# Altium schematic sheet Microcontroller.SchDoc: Microcontroller
size A3; Engineer: Y.Meyer; Organization: Altium Limited; Address1: Laboratoire de Systèmes Embarqués; Address2: 7, rue de la Serre; Address3: 2610 Saint-Imier / Switzerland; Revision: V1.0; SheetNumber: 1; SheetTotal: 10; ProjectName: LCI Mainboard
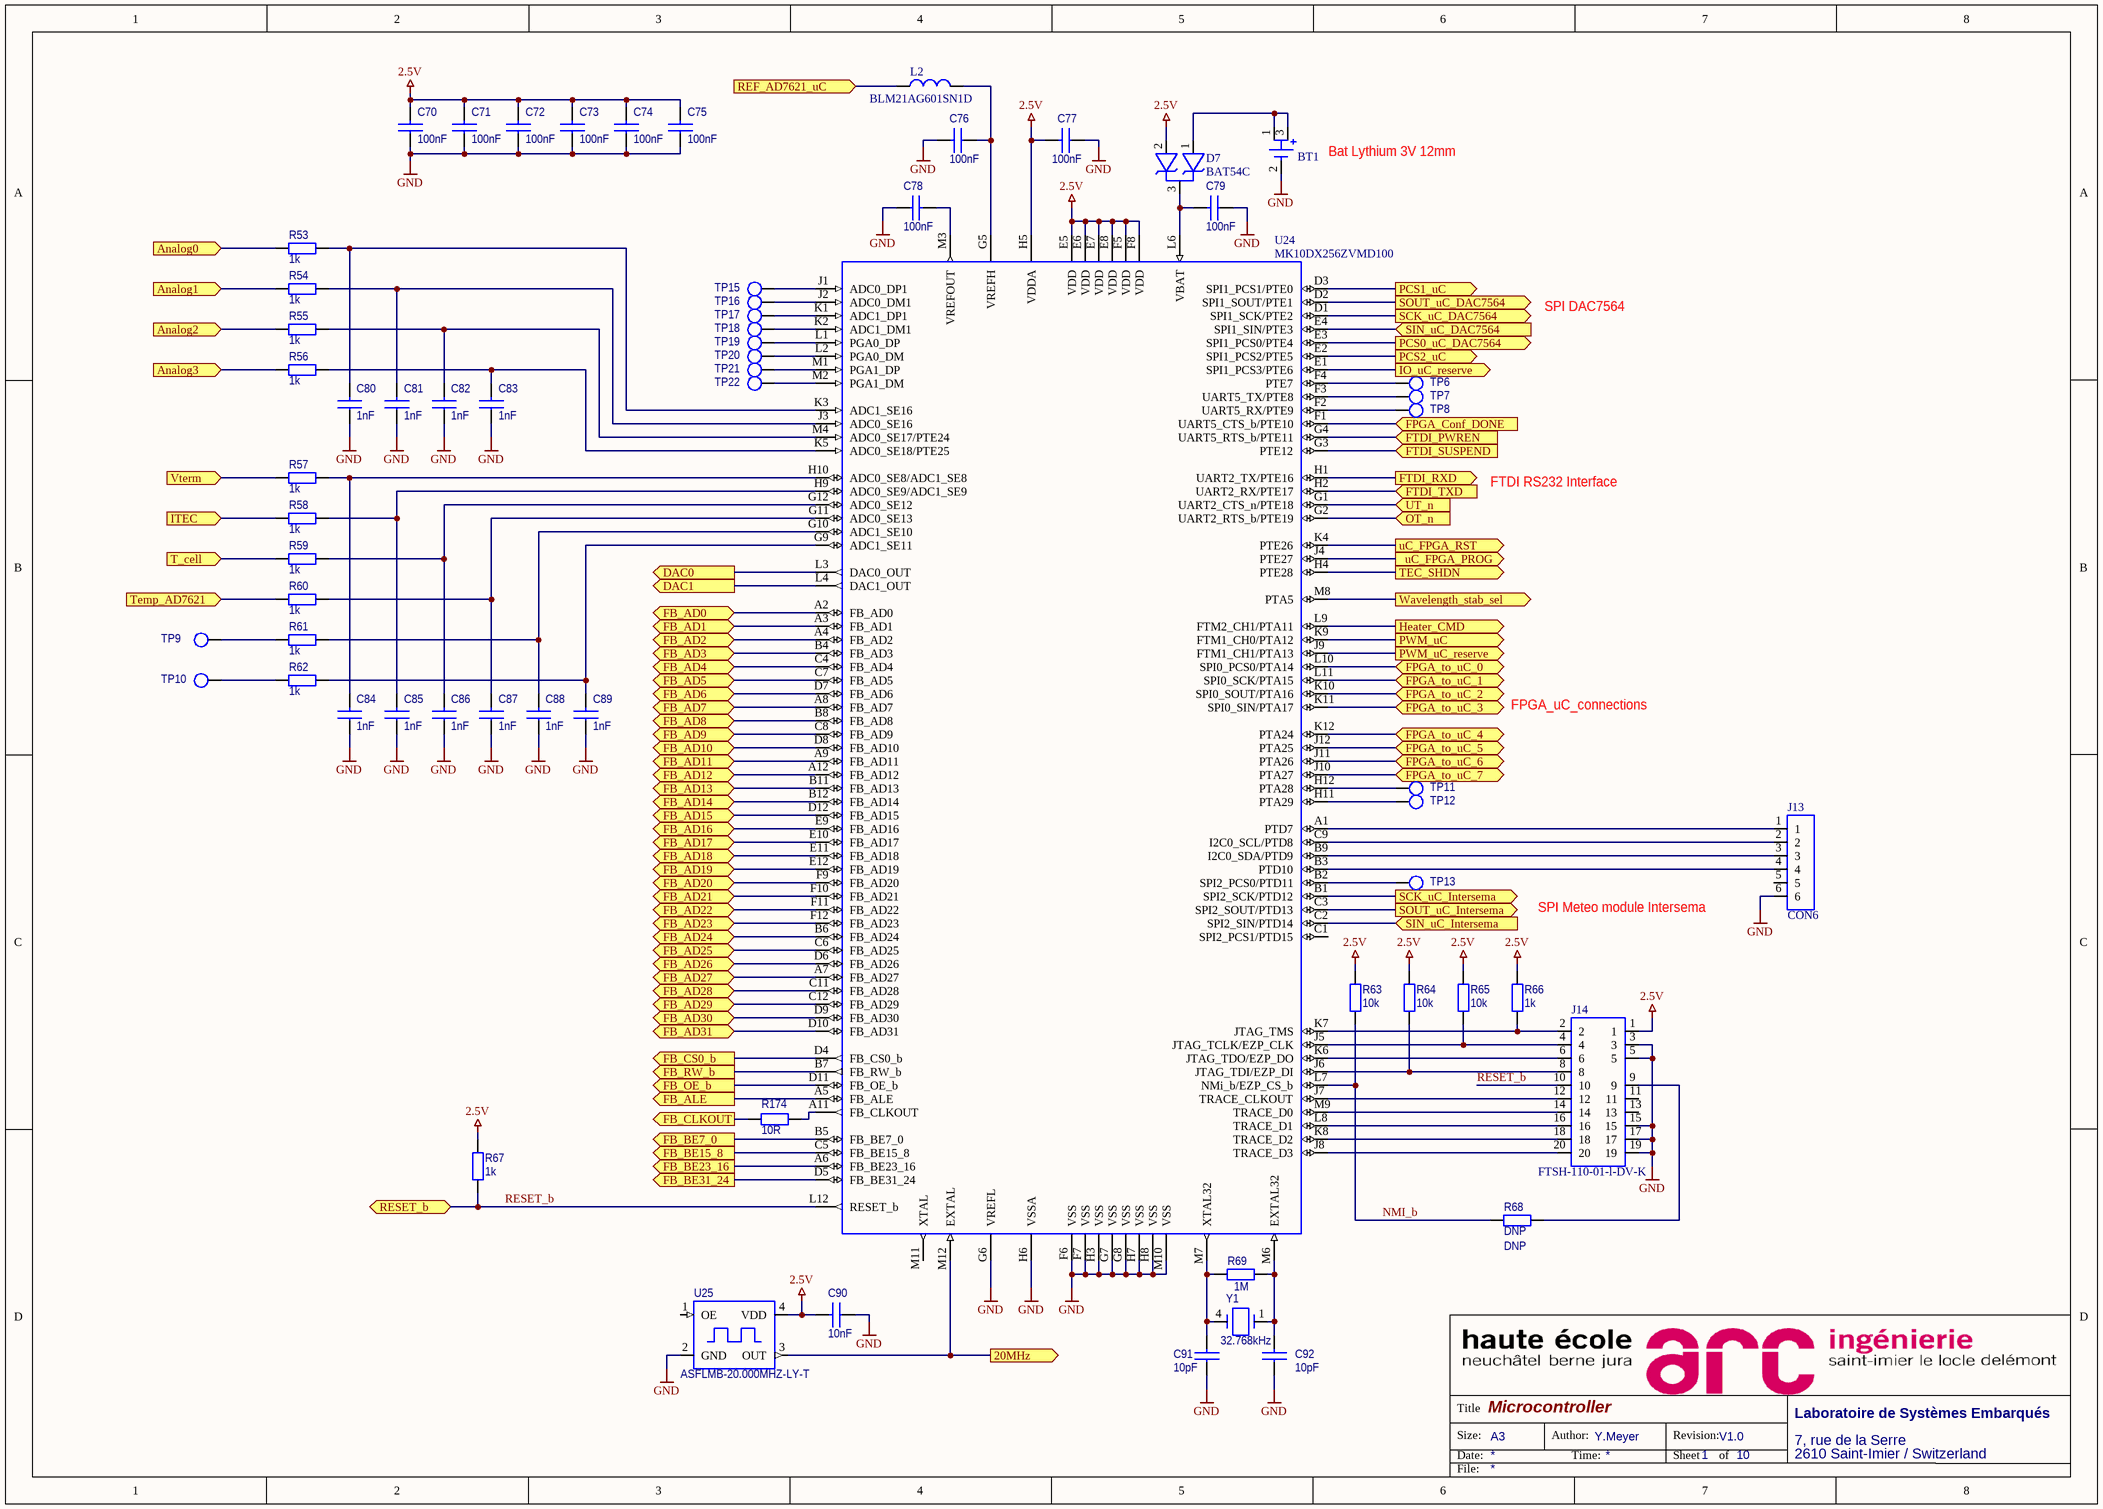
[diagram p0: Microcontroller.SchDoc]

## Parts
BT1  3000TR  [3000TR]  (value not drawn)
C70  100nF  [060301]
C71  100nF  [060301]
C72  100nF  [060301]
C73  100nF  [060301]
C74  100nF  [060301]
C75  100nF  [060301]
C76  100nF  [060301]
C77  100nF  [060301]
C78  100nF  [060301]
C79  100nF  [060301]
C80  1nF  [060301]
C81  1nF  [060301]
C82  1nF  [060301]
C83  1nF  [060301]
C84  1nF  [060301]
C85  1nF  [060301]
C86  1nF  [060301]
C87  1nF  [060301]
C88  1nF  [060301]
C89  1nF  [060301]
C90  10nF  [060301]
C91  10pF  [060301]
C92  10pF  [060301]
D7  BAT54C  [SOT2301]
J13  CON6  [J106A101]
J14  FTSH-110-01-l-DV-K  [FTSH-110-01-X-DV-EJ]
L2  BLM21AG601SN1D  [080501]
R53  1k  [060301]
R54  1k  [060301]
R55  1k  [060301]
R56  1k  [060301]
R57  1k  [060301]
R58  1k  [060301]
R59  1k  [060301]
R60  1k  [060301]
R61  1k  [060301]
R62  1k  [060301]
R63  10k  [060301]
R64  10k  [060301]
R65  10k  [060301]
R66  1k  [060301]
R67  1k  [060301]
R68  DNP  [060301]
R69  1M  [060301]
R174  10R  [060301]
TP6  Test point  [TP_SMD_06mm]  (value not drawn)
TP7  Test point  [TP_SMD_06mm]  (value not drawn)
TP8  Test point  [TP_SMD_06mm]  (value not drawn)
TP9  Test point  [TP_SMD_06mm]  (value not drawn)
TP10  Test point  [TP_SMD_06mm]  (value not drawn)
TP11  Test point  [TP_SMD_06mm]  (value not drawn)
TP12  Test point  [TP_SMD_06mm]  (value not drawn)
TP13  Test point  [TP_SMD_06mm]  (value not drawn)
TP15  Test point  [TP_SMD_06mm]  (value not drawn)
TP16  Test point  [TP_SMD_06mm]  (value not drawn)
TP17  Test point  [TP_SMD_06mm]  (value not drawn)
TP18  Test point  [TP_SMD_06mm]  (value not drawn)
TP19  Test point  [TP_SMD_06mm]  (value not drawn)
TP20  Test point  [TP_SMD_06mm]  (value not drawn)
TP21  Test point  [TP_SMD_06mm]  (value not drawn)
TP22  Test point  [TP_SMD_06mm]  (value not drawn)
U24  MK10DX256ZVMD100  [MAPBGA144]
U25  ASFLMB-20.000MHZ-LY-T  [OSC05]
Y1  value 32.768kHz  [XT-5]  (hidden comment: ECS-.327-12.5-17X-C-TR)

## Ports
20MHz (out), Analog0 (in), Analog1 (in), Analog2 (in), Analog3 (in), DAC0 (out), DAC1 (out), FB_AD0 (bidir), FB_AD1 (bidir), FB_AD2 (bidir), FB_AD3 (bidir), FB_AD4 (bidir), FB_AD5 (bidir), FB_AD6 (bidir), FB_AD7 (bidir), FB_AD8 (bidir), FB_AD9 (bidir), FB_AD10 (bidir), FB_AD11 (bidir), FB_AD12 (bidir), FB_AD13 (bidir), FB_AD14 (bidir), FB_AD15 (bidir), FB_AD16 (bidir), FB_AD17 (bidir), FB_AD18 (bidir), FB_AD19 (bidir), FB_AD20 (bidir), FB_AD21 (bidir), FB_AD22 (bidir), FB_AD23 (bidir), FB_AD24 (bidir), FB_AD25 (bidir), FB_AD26 (bidir), FB_AD27 (bidir), FB_AD28 (bidir), FB_AD29 (bidir), FB_AD30 (bidir), FB_AD31 (bidir), FB_ALE (out), FB_BE7_0 (out), FB_BE15_8 (out), FB_BE23_16 (out), FB_BE31_24 (out), FB_CLKOUT (out), FB_CS0_b (out), FB_OE_b (out), FB_RW_b (out), FPGA_Conf_DONE (in), FPGA_to_uC_0 (bidir), FPGA_to_uC_1 (bidir), FPGA_to_uC_2 (bidir), FPGA_to_uC_3 (bidir), FPGA_to_uC_4 (bidir), FPGA_to_uC_5 (bidir), FPGA_to_uC_6 (bidir), FPGA_to_uC_7 (bidir), FTDI_PWREN (in), FTDI_RXD (out), FTDI_SUSPEND (in), FTDI_TXD (in), Heater_CMD (out), IO_uC_reserve (out), ITEC (in), OT_n (in), PCS0_uC_DAC7564 (out), PCS1_uC (out), PCS2_uC (out), PWM_uC (out), PWM_uC_reserve (out), REF_AD7621_uC (in), RESET_b (bidir), SCK_uC_DAC7564 (out), SCK_uC_Intersema (out), SIN_uC_DAC7564 (in), SIN_uC_Intersema (in), SOUT_uC_DAC7564 (out), SOUT_uC_Intersema (out), T_cell (in), TEC_SHDN (out), Temp_AD7621 (in), uC_FPGA_PROG (out), uC_FPGA_RST (out), UT_n (in), Vterm (in), Wavelength_stab_sel (out)

## Nets
2.5V: C70.2 C71.2 C72.2 C73.2 C74.2 C75.2 C77.2 C90.2 D7.2(C2) J14.1 R63.1 R64.1 R65.1 R66.1 R67.1 U24.E5(VDD) U24.E6(VDD) U24.E7(VDD) U24.E8(VDD) U24.F5(VDD) U24.F8(VDD) U24.H5(VDDA) U25.4(VDD)
GND: BT1.2(C) C70.1 C71.1 C72.1 C73.1 C74.1 C75.1 C76.2 C77.1 C78.1 C79.1 C80.1 C81.1 C82.1 C83.1 C84.1 C85.1 C86.1 C87.1 C88.1 C89.1 C90.1 C91.1 C92.1 J13.6 J14.3 J14.5 J14.15 J14.17 J14.19 U24.F6(VSS) U24.F7(VSS) U24.G6(VREFL) U24.G7(VSS) U24.G8(VSS) U24.H3(VSS) U24.H6(VSSA) U24.H7(VSS) U24.H8(VSS) U24.M10(VSS) U25.2(GND)
20MHz: U24.M12(EXTAL) U25.3(OUT) ; port 20MHz
Analog0: R53.1 ; port Analog0
Analog1: R54.1 ; port Analog1
Analog2: R55.1 ; port Analog2
Analog3: R56.1 ; port Analog3
DAC0: U24.L3(DAC0_OUT) ; port DAC0
DAC1: U24.L4(DAC1_OUT) ; port DAC1
FB_AD0: U24.A2(FB_AD0) ; port FB_AD0
FB_AD1: U24.A3(FB_AD1) ; port FB_AD1
FB_AD2: U24.A4(FB_AD2) ; port FB_AD2
FB_AD3: U24.B4(FB_AD3) ; port FB_AD3
FB_AD4: U24.C4(FB_AD4) ; port FB_AD4
FB_AD5: U24.C7(FB_AD5) ; port FB_AD5
FB_AD6: U24.D7(FB_AD6) ; port FB_AD6
FB_AD7: U24.A8(FB_AD7) ; port FB_AD7
FB_AD8: U24.B8(FB_AD8) ; port FB_AD8
FB_AD9: U24.C8(FB_AD9) ; port FB_AD9
FB_AD10: U24.D8(FB_AD10) ; port FB_AD10
FB_AD11: U24.A9(FB_AD11) ; port FB_AD11
FB_AD12: U24.A12(FB_AD12) ; port FB_AD12
FB_AD13: U24.B11(FB_AD13) ; port FB_AD13
FB_AD14: U24.B12(FB_AD14) ; port FB_AD14
FB_AD15: U24.D12(FB_AD15) ; port FB_AD15
FB_AD16: U24.E9(FB_AD16) ; port FB_AD16
FB_AD17: U24.E10(FB_AD17) ; port FB_AD17
FB_AD18: U24.E11(FB_AD18) ; port FB_AD18
FB_AD19: U24.E12(FB_AD19) ; port FB_AD19
FB_AD20: U24.F9(FB_AD20) ; port FB_AD20
FB_AD21: U24.F10(FB_AD21) ; port FB_AD21
FB_AD22: U24.F11(FB_AD22) ; port FB_AD22
FB_AD23: U24.F12(FB_AD23) ; port FB_AD23
FB_AD24: U24.B6(FB_AD24) ; port FB_AD24
FB_AD25: U24.C6(FB_AD25) ; port FB_AD25
FB_AD26: U24.D6(FB_AD26) ; port FB_AD26
FB_AD27: U24.A7(FB_AD27) ; port FB_AD27
FB_AD28: U24.C11(FB_AD28) ; port FB_AD28
FB_AD29: U24.C12(FB_AD29) ; port FB_AD29
FB_AD30: U24.D9(FB_AD30) ; port FB_AD30
FB_AD31: U24.D10(FB_AD31) ; port FB_AD31
FB_ALE: U24.A5(FB_ALE) ; port FB_ALE
FB_BE7_0: U24.B5(FB_BE7_0) ; port FB_BE7_0
FB_BE15_8: U24.C5(FB_BE15_8) ; port FB_BE15_8
FB_BE23_16: U24.A6(FB_BE23_16) ; port FB_BE23_16
FB_BE31_24: U24.D5(FB_BE31_24) ; port FB_BE31_24
FB_CLKOUT: R174.1 ; port FB_CLKOUT
FB_CS0_b: U24.D4(FB_CS0_b) ; port FB_CS0_b
FB_OE_b: U24.D11(FB_OE_b) ; port FB_OE_b
FB_RW_b: U24.B7(FB_RW_b) ; port FB_RW_b
FPGA_Conf_DONE: U24.F1(UART5_CTS_b/PTE10) ; port FPGA_Conf_DONE
FPGA_to_uC_0: U24.L10(SPI0_PCS0/PTA14) ; port FPGA_to_uC_0
FPGA_to_uC_1: U24.L11(SPI0_SCK/PTA15) ; port FPGA_to_uC_1
FPGA_to_uC_2: U24.K10(SPI0_SOUT/PTA16) ; port FPGA_to_uC_2
FPGA_to_uC_3: U24.K11(SPI0_SIN/PTA17) ; port FPGA_to_uC_3
FPGA_to_uC_4: U24.K12(PTA24) ; port FPGA_to_uC_4
FPGA_to_uC_5: U24.J12(PTA25) ; port FPGA_to_uC_5
FPGA_to_uC_6: U24.J11(PTA26) ; port FPGA_to_uC_6
FPGA_to_uC_7: U24.J10(PTA27) ; port FPGA_to_uC_7
FTDI_PWREN: U24.G4(UART5_RTS_b/PTE11) ; port FTDI_PWREN
FTDI_RXD: U24.H1(UART2_TX/PTE16) ; port FTDI_RXD
FTDI_SUSPEND: U24.G3(PTE12) ; port FTDI_SUSPEND
FTDI_TXD: U24.H2(UART2_RX/PTE17) ; port FTDI_TXD
Heater_CMD: U24.L9(FTM2_CH1/PTA11) ; port Heater_CMD
IO_uC_reserve: U24.E1(SPI1_PCS3/PTE6) ; port IO_uC_reserve
ITEC: R58.1 ; port ITEC
NMI_b: R63.2 R68.1 U24.L7(NMi_b/EZP_CS_b)
OT_n: U24.G2(UART2_RTS_b/PTE19) ; port OT_n
PCS0_uC_DAC7564: U24.E3(SPI1_PCS0/PTE4) ; port PCS0_uC_DAC7564
PCS1_uC: U24.D3(SPI1_PCS1/PTE0) ; port PCS1_uC
PCS2_uC: U24.E2(SPI1_PCS2/PTE5) ; port PCS2_uC
PWM_uC: U24.K9(FTM1_CH0/PTA12) ; port PWM_uC
PWM_uC_reserve: U24.J9(FTM1_CH1/PTA13) ; port PWM_uC_reserve
REF_AD7621_uC: L2.1 ; port REF_AD7621_uC
RESET_b: J14.10 R67.2 U24.L12(RESET_b) ; port RESET_b
SCK_uC_DAC7564: U24.D1(SPI1_SCK/PTE2) ; port SCK_uC_DAC7564
SCK_uC_Intersema: U24.B1(SPI2_SCK/PTD12) ; port SCK_uC_Intersema
SIN_uC_DAC7564: U24.E4(SPI1_SIN/PTE3) ; port SIN_uC_DAC7564
SIN_uC_Intersema: U24.C2(SPI2_SIN/PTD14) ; port SIN_uC_Intersema
SOUT_uC_DAC7564: U24.D2(SPI1_SOUT/PTE1) ; port SOUT_uC_DAC7564
SOUT_uC_Intersema: U24.C3(SPI2_SOUT/PTD13) ; port SOUT_uC_Intersema
T_cell: R59.1 ; port T_cell
TEC_SHDN: U24.H4(PTE28) ; port TEC_SHDN
Temp_AD7621: R60.1 ; port Temp_AD7621
uC_FPGA_PROG: U24.J4(PTE27) ; port uC_FPGA_PROG
uC_FPGA_RST: U24.K4(PTE26) ; port uC_FPGA_RST
UT_n: U24.G1(UART2_CTS_n/PTE18) ; port UT_n
Vterm: R57.1 ; port Vterm
Wavelength_stab_sel: U24.M8(PTA5) ; port Wavelength_stab_sel
NetBT1_1: BT1.1(A1) BT1.3(A2) D7.1(C1)
NetC76_1: C76.1 L2.2 U24.G5(VREFH)
NetC78_2: C78.2 U24.M3(VREFOUT)
NetC79_2: C79.2 D7.3(Anode) U24.L6(VBAT)
NetC80_2: C80.2 R53.2 U24.K3(ADC1_SE16)
NetC81_2: C81.2 R54.2 U24.J3(ADC0_SE16)
NetC82_2: C82.2 R55.2 U24.M4(ADC0_SE17/PTE24)
NetC83_2: C83.2 R56.2 U24.K5(ADC0_SE18/PTE25)
NetC84_2: C84.2 R57.2 U24.H10(ADC0_SE8/ADC1_SE8)
NetC85_2: C85.2 R58.2 U24.H9(ADC0_SE9/ADC1_SE9)
NetC86_2: C86.2 R59.2 U24.G12(ADC0_SE12)
NetC87_2: C87.2 R60.2 U24.G11(ADC0_SE13)
NetC88_2: C88.2 R61.2 U24.G10(ADC1_SE10)
NetC89_2: C89.2 R62.2 U24.G9(ADC1_SE11)
NetC91_2: C91.2 R69.1 U24.M7(XTAL32) Y1.4
NetC92_2: C92.2 R69.2 U24.M6(EXTAL32) Y1.1
NetJ13_1: J13.1 U24.A1(PTD7)
NetJ13_2: J13.2 U24.C9(I2C0_SCL/PTD8)
NetJ13_3: J13.3 U24.B9(I2C0_SDA/PTD9)
NetJ13_4: J13.4 U24.B3(PTD10)
NetJ14_2: J14.2 R66.2 U24.K7(JTAG_TMS)
NetJ14_4: J14.4 R65.2 U24.J5(JTAG_TCLK/EZP_CLK)
NetJ14_6: J14.6 U24.K6(JTAG_TDO/EZP_DO)
NetJ14_8: J14.8 R64.2 U24.J6(JTAG_TDI/EZP_DI)
NetJ14_9: J14.9 R68.2
NetJ14_12: J14.12 U24.J7(TRACE_CLKOUT)
NetJ14_14: J14.14 U24.M9(TRACE_D0)
NetJ14_16: J14.16 U24.L8(TRACE_D1)
NetJ14_18: J14.18 U24.K8(TRACE_D2)
NetJ14_20: J14.20 U24.J8(TRACE_D3)
NetR61_1: R61.1 TP9.1(TP)
NetR62_1: R62.1 TP10.1(TP)
NetR174_2: R174.2 U24.A11(FB_CLKOUT)
NetTP6_1: TP6.1(TP) U24.F4(PTE7)
NetTP7_1: TP7.1(TP) U24.F3(UART5_TX/PTE8)
NetTP8_1: TP8.1(TP) U24.F2(UART5_RX/PTE9)
NetTP11_1: TP11.1(TP) U24.H12(PTA28)
NetTP12_1: TP12.1(TP) U24.H11(PTA29)
NetTP13_1: TP13.1(TP) U24.B2(SPI2_PCS0/PTD11)
NetTP15_1: TP15.1(TP) U24.J1(ADC0_DP1)
NetTP16_1: TP16.1(TP) U24.J2(ADC0_DM1)
NetTP17_1: TP17.1(TP) U24.K1(ADC1_DP1)
NetTP18_1: TP18.1(TP) U24.K2(ADC1_DM1)
NetTP19_1: TP19.1(TP) U24.L1(PGA0_DP)
NetTP20_1: TP20.1(TP) U24.L2(PGA0_DM)
NetTP21_1: TP21.1(TP) U24.M1(PGA1_DP)
NetTP22_1: TP22.1(TP) U24.M2(PGA1_DM)

Not connected (* = marked no-connect by the designer): J13 5; J14 11 13; U24 C1(SPI2_PCS1/PTD15) M11(XTAL); U25 1(OE)

## Notes on the sheet
- (near BT1) Bat Lythium 3V 12mm
- SPI DAC7564
- FTDI RS232 Interface
- FPGA_uC_connections
- SPI Meteo module Intersema
- Title
- Size:
- Date:
- A3
- Author:
- Time:
- Revision:
- Sheet
- of
- File:

## Library data of the parts
BT1 = BAT_1: HOLDER BATTERY COIN 12MM DIA SMD; Manufacturer: Keystone Electronics; Supplier 1: Digi-Key; Supplier Part Number 1: 3000KTR-ND; Part Name: 3000TR
C70-C79 = CAPA: CAP CER 0.1UF 25V 10% X7R 0603; Manufacturer: TDK Corporation; Part Name: C1608X7R1E104K; Value: 100nF; Supplier 1: Digi-Key; Supplier Part Number 1: 445-1316-2-ND; Voltage: 25V
C80-C89 = CAPA: CAP CER 1000PF 50V 10% X7R 0603; Manufacturer: Murata; Part Name: GRM188R71H102KA01D; Value: 1nF; Supplier 1: Digi-Key; Supplier Part Number 1: 490-1494-2-ND
C90 = CAPA: CAP CER 10000PF 50V 10% X7R 0; Part Name: B37931K5103K070-ND; Manufacturer: EPCOS Inc; Value: 10nF; Supplier 1: Digi-Key; Supplier Part Number 1: B37931K5103K070-ND
C91 C92 = CAPA: CAP CER 10PF 50V 5% NP0 0603; Part Name: C0603C100J5GACTU; Manufacturer: Kemet; Value: 10pF; Supplier 1: Digi-Key; Supplier Part Number 1: 399-1049-2-ND; Voltage: 50V
D7 = BAT54C: DIODE SCHTTKY CC 200MA 30V SOT23; Manufacturer: Comchip Technology; Part Name: BAT54C-G; Supplier 1: Digi-Key; Supplier Part Number 1: 641-1320-1-ND
J13 = CON6: Barette 6 pin
J14 = CON20_JTAG: CONN UNSHROUDED HDR 20POS .05"; Manufacturer: Samtec Inc; Part Name: FTSH-110-01-L-DV-K-P-TR; Supplier 1: Samtec Inc; Supplier Part Number 1: FTSH-110-01-L-DV-K-P-TR
L2 = Ferrite Bead: FERRITE CHIP 600 OHM 200MA 0805; Manufacturer: Murata Electronics; Value: 600R@100MHz; Part Name: BLM21AG601SN1D; Supplier 1: Digi-Key; Supplier Part Number 1: 490-1040-6-ND
R53-R62 R66 R67 = RES: RES 1.00K OHM 1/10W 1% 0603 SMD; Manufacturer: Yageo; Part Name: RC0603FR-071KL; Value: 1k; Supplier 1: Digi-Key; Supplier Part Number 1: 311-1.00KHRCT-ND
R63-R65 = RES: RES 10.0K OHM 1/10W 1% 0603 SMD; Manufacturer: Yageo; Part Name: RC0603FR-0710KL; Value: 10k; Supplier 1: Digi-Key; Supplier Part Number 1: 311-10.0KHRCT-ND
R68 = RES: RES 0.0 OHM 1/10W 0603 SMD; Manufacturer: Yageo; Part Name: RC0603JR-070RL; Value: 0R; DNP: DNP; Supplier 1: Digi-Key; Supplier Part Number 1: RC0603JR-070RL
R69 = RES: RES 1.00M OHM 1/10W 1% 0603 SMD; Manufacturer: Yageo; Part Name: RC0603FR-071ML; Value: 1M; Supplier 1: Digi-Key; Supplier Part Number 1: 311-1.00MHRCT-ND
R174 = RES: RES 10.0 OHM 1/10W 1% 0603 SMD; Manufacturer: Yageo; Part Name: RC0603FR-0710RL; Value: 10R; Supplier 1: Digi-Key; Supplier Part Number 1: 311-10.0HRTR-ND
TP6-TP13 TP15-TP22 = TP
U24 = MK10X256VMD100: IC ARM CORTEX MCU 256K 144-MAP; Manufacturer: Freescale Semiconductor; Part Name: MK10DX256ZVMD100; Supplier 1: Digi-Key
U25 = Oscillateur: OSC MEMS 20.000 MHZ SMD; Manufacturer: Abracon Corporation; Value: 20MHz; Supplier 1: Digi-Key; Supplier Part Number 1: 535-11022-1-ND; Part Name: ASFLMB-20.000MHZ-LY-T
Y1 = Crystal_32: CRYSTAL 32.768 KHZ 12.5PF SMD; Manufacturer: ECS Inc; Supplier 1: Digi-Key; Supplier Part Number 1: XC1912CT-ND; Part Name: ECS-.327-12.5-17X-C-TR